# Altium schematic sheet Project.SchDoc
size A4; SheetNumber: 1; SheetTotal: 6
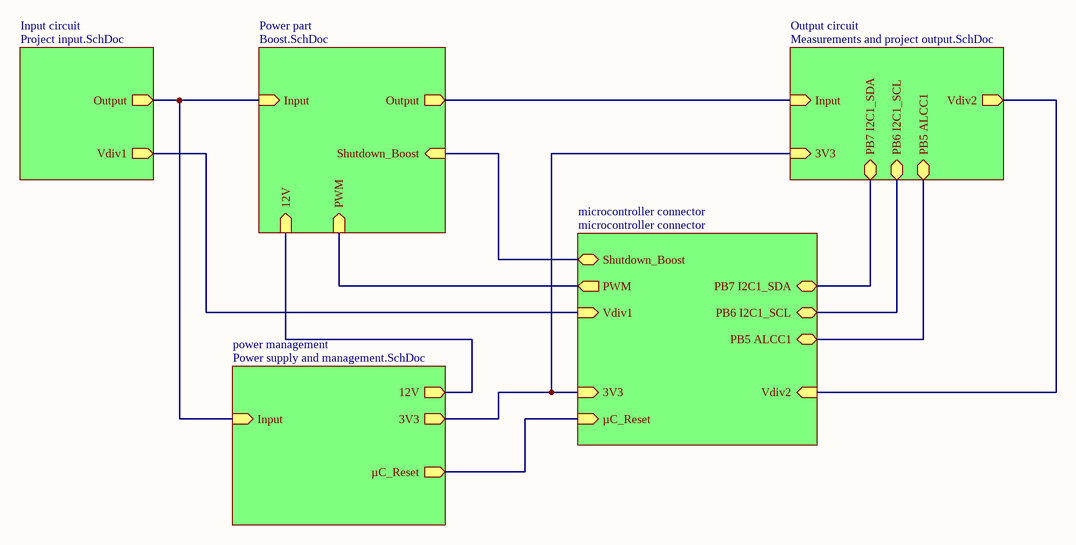
[diagram p0: Project.SchDoc]

## Sub-sheets
Input circuit = Project input.SchDoc: Output (out), Vdiv1 (out)
microcontroller connector = microcontroller connector: Vdiv1 (in), Vdiv2 (in), µC_Reset (in), Shutdown_Boost (bidir), 3V3 (in), PB7 I2C1_SDA (bidir), PB6 I2C1_SCL (bidir), PB5 ALCC1 (bidir), PWM (out)
Output circuit  = Measurements and project output.SchDoc: Input (in), Vdiv2 (out), PB6 I2C1_SCL (bidir), PB5 ALCC1 (bidir), PB7 I2C1_SDA (bidir), 3V3 (in)
power management = Power supply and management.SchDoc: Input (in), 3V3 (out), 12V (out), µC_Reset (out)
Power part = Boost.SchDoc: Input (in), Output (out), PWM (in), 12V (in), Shutdown_Boost (in)

## Nets
(unnamed): sheet microcontroller connector/Vdiv1, sheet Input circuit/Vdiv1
(unnamed): sheet microcontroller connector/Vdiv2, sheet Output circuit /Vdiv2
(unnamed): sheet microcontroller connector/µC_Reset, sheet power management/µC_Reset
(unnamed): sheet microcontroller connector/Shutdown_Boost, sheet Power part/Shutdown_Boost
(unnamed): sheet microcontroller connector/3V3, sheet Output circuit /3V3, sheet power management/3V3
(unnamed): sheet microcontroller connector/PB7 I2C1_SDA, sheet Output circuit /PB7 I2C1_SDA
(unnamed): sheet microcontroller connector/PB6 I2C1_SCL, sheet Output circuit /PB6 I2C1_SCL
(unnamed): sheet microcontroller connector/PB5 ALCC1, sheet Output circuit /PB5 ALCC1
(unnamed): sheet microcontroller connector/PWM, sheet Power part/PWM
(unnamed): sheet Input circuit/Output, sheet Power part/Input, sheet power management/Input
(unnamed): sheet Power part/Output, sheet Output circuit /Input
(unnamed): sheet Power part/12V, sheet power management/12V